# Altium schematic sheet MPPT_MCU.SchDoc
size A3; SheetNumber: 2; SheetTotal: 3
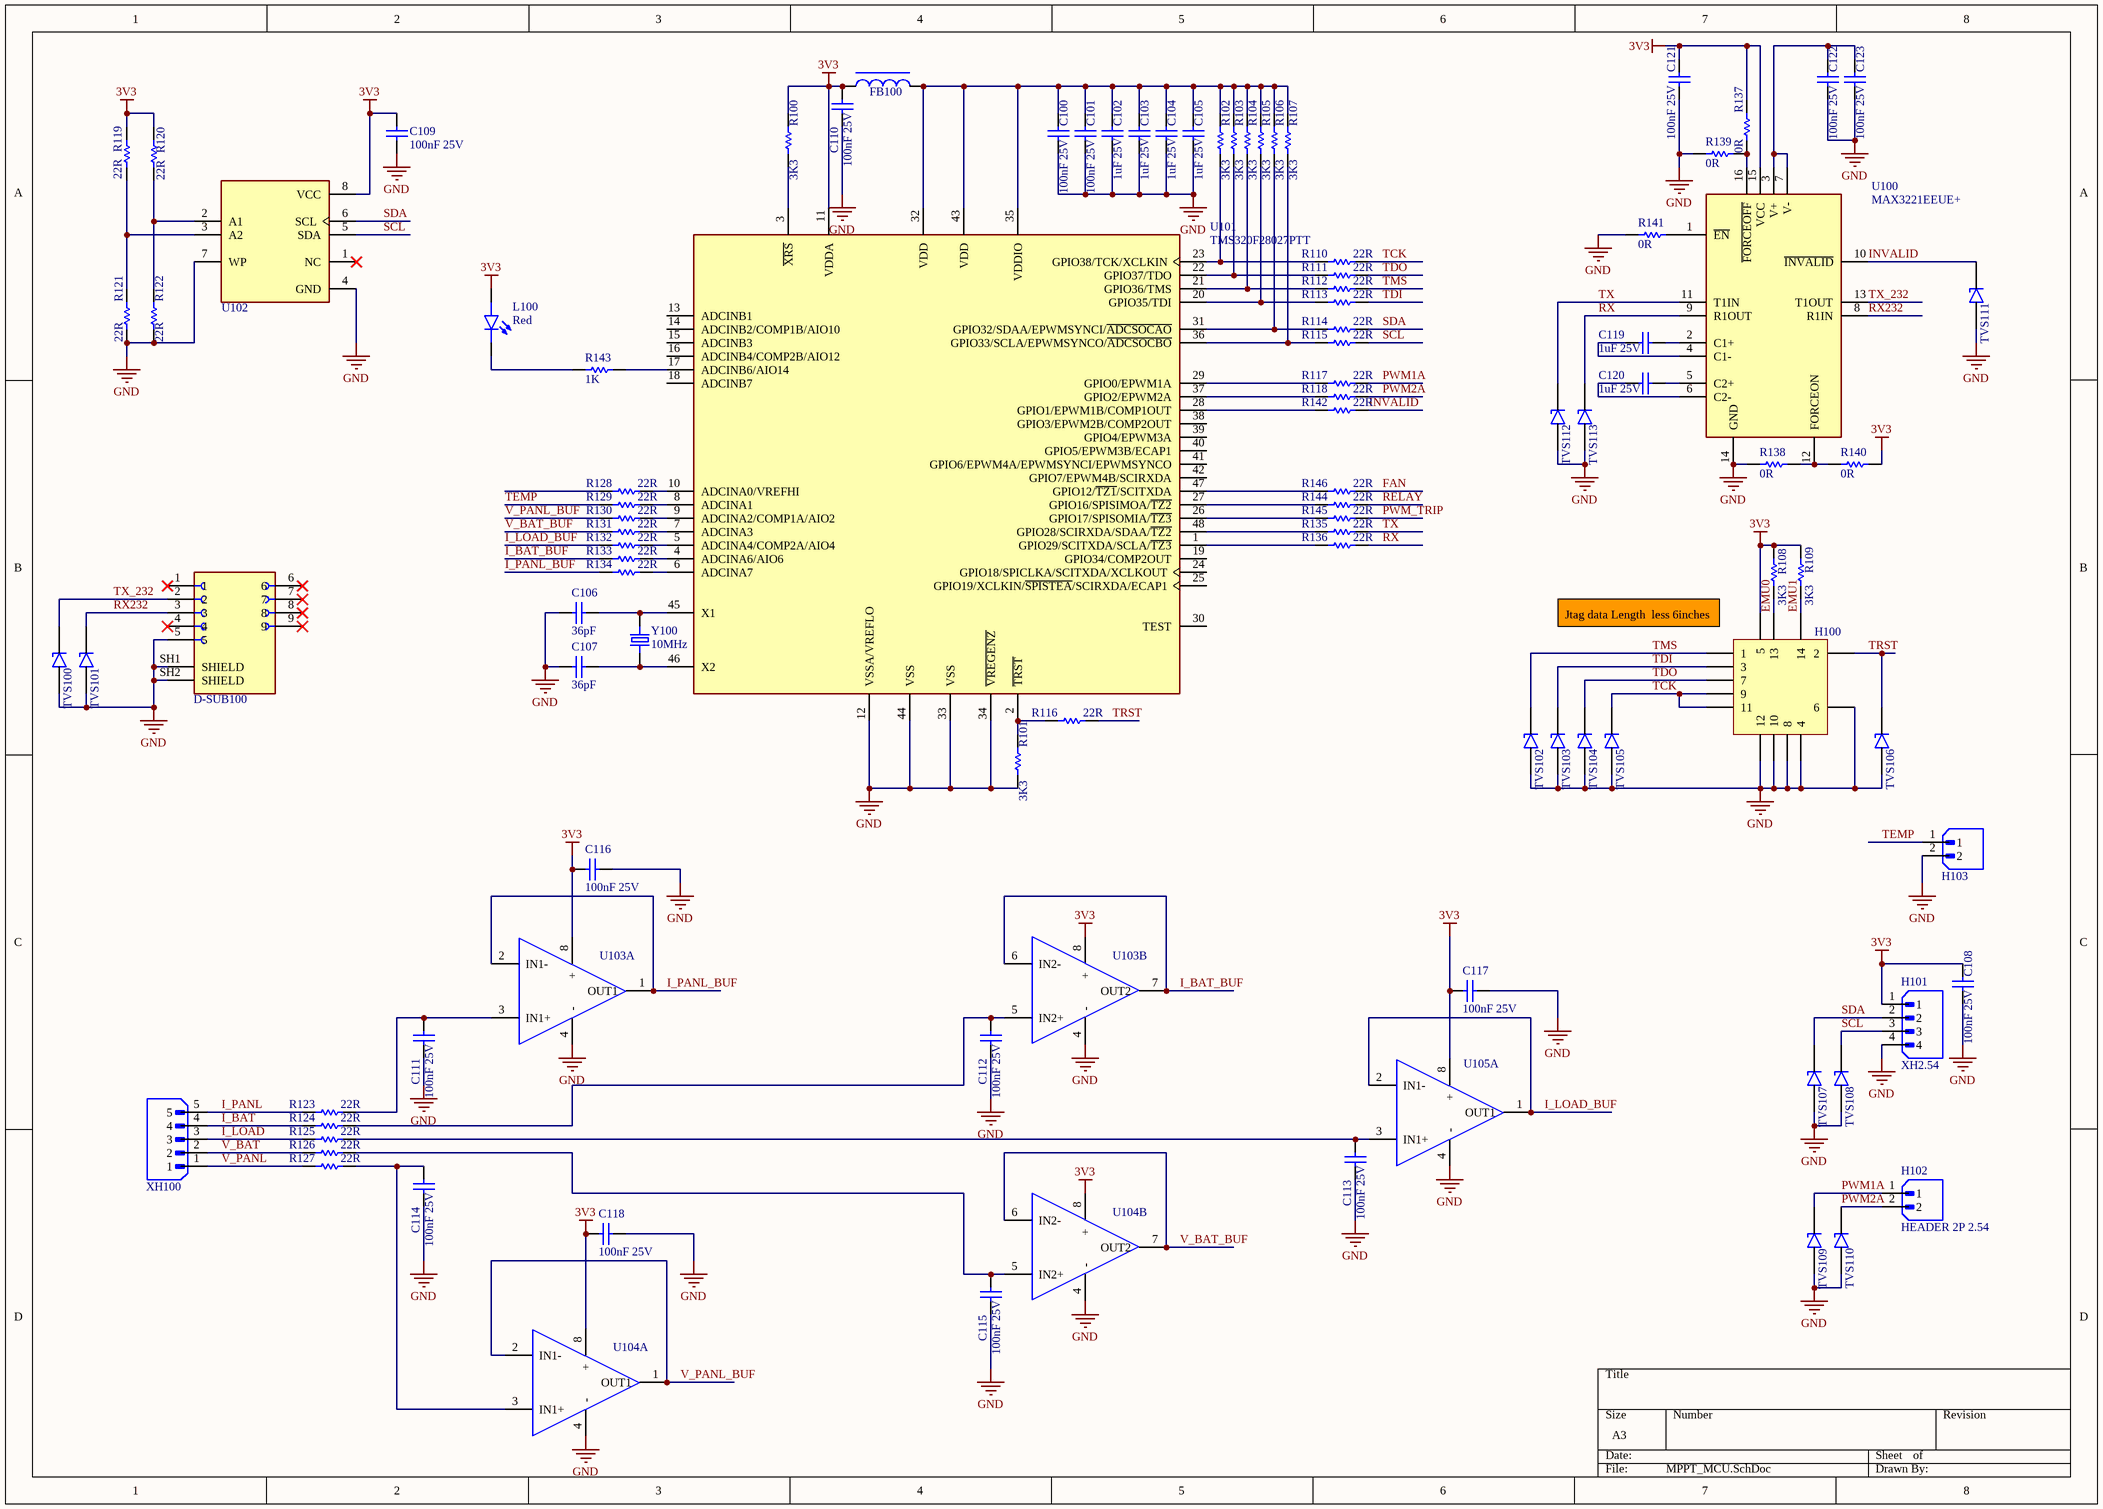
[diagram p0: MPPT_MCU.SchDoc]

## Parts
C100  100nF 25V  [Cap cer 0603]
C101  100nF 25V  [Cap cer 0603]
C102  1uF 25V  [Cap cer 0603]
C103  1uF 25V  [Cap cer 0603]
C104  1uF 25V  [Cap cer 0603]
C105  1uF 25V  [Cap cer 0603]
C106  36pF  [Cap cer 0603]
C107  36pF  [Cap cer 0603]
C108  100nF 25V  [Cap cer 0603]
C109  100nF 25V  [Cap cer 0603]
C110  100nF 25V  [Cap cer 0603]
C111  100nF 25V  [Cap cer 0603]
C112  100nF 25V  [Cap cer 0603]
C113  100nF 25V  [Cap cer 0603]
C114  100nF 25V  [Cap cer 0603]
C115  100nF 25V  [Cap cer 0603]
C116  100nF 25V  [Cap cer 0603]
C117  100nF 25V  [Cap cer 0603]
C118  100nF 25V  [Cap cer 0603]
C119  1uF 25V  [Cap cer 0603]
C120  1uF 25V  [Cap cer 0603]
C121  100nF 25V  [Cap cer 0603]
C122  100nF 25V  [Cap cer 0603]
C123  100nF 25V  [Cap cer 0603]
D-SUB100  9PIN  [D-SUB]  (value not drawn)
FB100  Ferrite Beads Multi-Layer 390Ohm 25% 100MHz 500mA 300mOhm DCR 0603 Automotive T/R  [FERRITE BEAD 0603]  (value not drawn)
H100  HDR2X7 2.54mm  [HDR2X7]  (value not drawn)
H101  XH2.54  [XH2.54]
H102  HEADER 2P 2.54  [HEADER 2P 2.544]
H103  HEADER 2P 2.54  [HEADER 2P 2.544]  (value not drawn)
L100  Red  [Led 0603]
R100  3K3  [Res 0603]
R101  3K3  [Res 0603]
R102  3K3  [Res 0603]
R103  3K3  [Res 0603]
R104  3K3  [Res 0603]
R105  3K3  [Res 0603]
R106  3K3  [Res 0603]
R107  3K3  [Res 0603]
R108  3K3  [Res 0603]
R109  3K3  [Res 0603]
R110  22R  [Res 0603]
R111  22R  [Res 0603]
R112  22R  [Res 0603]
R113  22R  [Res 0603]
R114  22R  [Res 0603]
R115  22R  [Res 0603]
R116  22R  [Res 0603]
R117  22R  [Res 0603]
R118  22R  [Res 0603]
R119  22R  [Res 0603]
R120  22R  [Res 0603]
R121  22R  [Res 0603]
R122  22R  [Res 0603]
R123  22R  [Res 0603]
R124  22R  [Res 0603]
R125  22R  [Res 0603]
R126  22R  [Res 0603]
R127  22R  [Res 0603]
R128  22R  [Res 0603]
R129  22R  [Res 0603]
R130  22R  [Res 0603]
R131  22R  [Res 0603]
R132  22R  [Res 0603]
R133  22R  [Res 0603]
R134  22R  [Res 0603]
R135  22R  [Res 0603]
R136  22R  [Res 0603]
R137  0R  [Res 0603]
R138  0R  [Res 0603]
R139  0R  [Res 0603]
R140  0R  [Res 0603]
R141  0R  [Res 0603]
R142  22R  [Res 0603]
R143  1K  [Res 0603]
R144  22R  [Res 0603]
R145  22R  [Res 0603]
R146  22R  [Res 0603]
TVS100  SMCJ5.0A-13-F  [TVS 5V]  (value not drawn)
TVS101  SMCJ5.0A-13-F  [TVS 5V]  (value not drawn)
TVS102  SMCJ5.0A-13-F  [TVS 5V]  (value not drawn)
TVS103  SMCJ5.0A-13-F  [TVS 5V]  (value not drawn)
TVS104  SMCJ5.0A-13-F  [TVS 5V]  (value not drawn)
TVS105  SMCJ5.0A-13-F  [TVS 5V]  (value not drawn)
TVS106  SMCJ5.0A-13-F  [TVS 5V]  (value not drawn)
TVS107  SMCJ5.0A-13-F  [TVS 5V]  (value not drawn)
TVS108  SMCJ5.0A-13-F  [TVS 5V]  (value not drawn)
TVS109  SMCJ5.0A-13-F  [TVS 5V]  (value not drawn)
TVS110  SMCJ5.0A-13-F  [TVS 5V]  (value not drawn)
TVS111  SMCJ5.0A-13-F  [TVS 5V]  (value not drawn)
TVS112  SMCJ5.0A-13-F  [TVS 5V]  (value not drawn)
TVS113  SMCJ5.0A-13-F  [TVS 5V]  (value not drawn)
U100  MAX3221EEUE+  [max3221]
U101  TMS320F28027PTT  [TMS320F28027PTT]
U102  AT24C04D-SSHM-B  [AT24C04D]  (value not drawn)
U103  LM358DT  [LM358]  (value not drawn)  (parts A,B of 2)
U104  LM358DT  [LM358]  (value not drawn)  (parts A,B of 2)
U105  LM358DT  [LM358]  (value not drawn)  (part A of 2)
XH100  B5B-XH-A(LF)(SN)  [XH2.54 5p]  (value not drawn)
Y100  10MHz  [Crystal 10Mhz]

## Nets
3V3: C108.2 C109.2 C110.2 C116.2 C117.2 C118.2 C121.2 FB100.1 H100.5 H101.1 L100.A R100.2 R108.2 R109.2 R119.2 R120.2 R137.2 R140.1 U100.15(VCC) U101.11(VDDA) U102.8(VCC) U103.8(+) U104.8(+) U105.8(+)
GND: C100.1 C101.1 C102.1 C103.1 C104.1 C105.1 C106.2 C107.2 C108.1 C109.1 C110.1 C111.1 C112.1 C113.1 C114.1 C115.1 C116.1 C117.1 C118.1 C121.1 C122.1 C123.1 D-SUB100.5 D-SUB100.SH1(SHIELD) D-SUB100.SH2(SHIELD) H100.4 H100.6 H100.8 H100.10 H100.12 H101.4 H103.2 R101.1 R121.1 R122.1 R138.2 R139.2 R141.2 TVS100.2(A) TVS101.2(A) TVS102.2(A) TVS103.2(A) TVS104.2(A) TVS105.2(A) TVS106.2(A) TVS107.2(A) TVS108.2(A) TVS109.2(A) TVS110.2(A) TVS111.2(A) TVS112.2(A) TVS113.2(A) U100.14(GND) U101.12(VSSA/VREFLO) U101.33(VSS) U101.34(~{VREGENZ}) U101.44(VSS) U102.4(GND) U102.7(WP) U103.4(-) U104.4(-) U105.4(-)
EMU0: H100.13 R108.1
EMU1: H100.14 R109.1
FAN: R146.2
I_BAT: R124.1 XH100.4
I_BAT_BUF: R133.1 U103.6(IN2-) U103.7(OUT2)
I_LOAD: R125.1 XH100.3
I_LOAD_BUF: R132.1 U105.1(OUT1) U105.2(IN1-)
I_PANL: R123.1 XH100.5
I_PANL_BUF: R134.1 U103.1(OUT1) U103.2(IN1-)
INVALID: R142.2 TVS111.1(C) U100.10(~{INVALID})
PWM1A: H102.1 R117.2 TVS109.1(C)
PWM2A: H102.2 R118.2 TVS110.1(C)
PWM_TRIP: R145.2
RELAY: R144.2
RX: R136.2 TVS113.1(C) U100.9(R1OUT)
RX232: D-SUB100.3 TVS101.1(C) U100.8(R1IN)
SCL: H101.3 R115.2 TVS108.1(C) U102.5(SDA)
SDA: H101.2 R114.2 TVS107.1(C) U102.6(SCL)
TCK: H100.9 H100.11 R110.2 TVS105.1(C)
TDI: H100.3 R113.2 TVS103.1(C)
TDO: H100.7 R111.2 TVS104.1(C)
TEMP: H103.1 R129.1
TMS: H100.1 R112.2 TVS102.1(C)
TRST: H100.2 R116.2 TVS106.1(C)
TX: R135.2 TVS112.1(C) U100.11(T1IN)
TX_232: D-SUB100.2 TVS100.1(C) U100.13(T1OUT)
V_BAT: R126.1 XH100.2
V_BAT_BUF: R131.1 U104.6(IN2-) U104.7(OUT2)
V_PANL: R127.1 XH100.1
V_PANL_BUF: R130.1 U104.1(OUT1) U104.2(IN1-)
NetC100_2: C100.2 C101.2 C102.2 C103.2 C104.2 C105.2 FB100.2 R102.2 R103.2 R104.2 R105.2 R106.2 R107.2 U101.32(VDD) U101.35(VDDIO) U101.43(VDD)
NetC106_1: C106.1 U101.45(X1) Y100.2
NetC107_1: C107.1 U101.46(X2) Y100.1
NetC111_2: C111.2 R123.2 U103.3(IN1+)
NetC112_2: C112.2 R124.2 U103.5(IN2+)
NetC113_2: C113.2 R125.2 U105.3(IN1+)
NetC114_2: C114.2 R127.2 U104.3(IN1+)
NetC115_2: C115.2 R126.2 U104.5(IN2+)
NetC119_1: C119.1 U100.2(C1+)
NetC119_2: C119.2 U100.4(C1-)
NetC120_1: C120.1 U100.5(C2+)
NetC120_2: C120.2 U100.6(C2-)
NetC122_2: C122.2 C123.2 U100.3(V+) U100.7(V-)
NetL100_C: L100.C R143.1
NetR100_1: R100.1 U101.3(~{XRS})
NetR101_2: R101.2 R116.1 U101.2(~{TRST})
NetR102_1: R102.1 R110.1 U101.23(GPIO38/TCK/XCLKIN)
NetR103_1: R103.1 R111.1 U101.22(GPIO37/TDO)
NetR104_1: R104.1 R112.1 U101.21(GPIO36/TMS)
NetR105_1: R105.1 R113.1 U101.20(GPIO35/TDI)
NetR106_1: R106.1 R114.1 U101.31(GPIO32/SDAA/EPWMSYNCI/~{ADCSOCAO})
NetR107_1: R107.1 R115.1 U101.36(GPIO33/SCLA/EPWMSYNCO/~{ADCSOCBO})
NetR117_1: R117.1 U101.29(GPIO0/EPWM1A)
NetR118_1: R118.1 U101.37(GPIO2/EPWM2A)
NetR119_1: R119.1 R121.2 U102.3(A2)
NetR120_1: R120.1 R122.2 U102.2(A1)
NetR128_2: R128.2 U101.10(ADCINA0/VREFHI)
NetR129_2: R129.2 U101.8(ADCINA1)
NetR130_2: R130.2 U101.9(ADCINA2/COMP1A/AIO2)
NetR131_2: R131.2 U101.7(ADCINA3)
NetR132_2: R132.2 U101.5(ADCINA4/COMP2A/AIO4)
NetR133_2: R133.2 U101.4(ADCINA6/AIO6)
NetR134_2: R134.2 U101.6(ADCINA7)
NetR135_1: R135.1 U101.48(GPIO28/SCIRXDA/SDAA/~{TZ2})
NetR136_1: R136.1 U101.1(GPIO29/SCITXDA/SCLA/~{TZ3})
NetR137_1: R137.1 R139.1 U100.16(~{FORCEOFF})
NetR138_1: R138.1 R140.2 U100.12(FORCEON)
NetR141_1: R141.1 U100.1(~{EN})
NetR142_1: R142.1 U101.28(GPIO1/EPWM1B/COMP1OUT)
NetR143_2: R143.2 U101.17(ADCINB6/AIO14)
NetR144_1: R144.1 U101.27(GPIO16/SPISIMOA/~{TZ2})
NetR145_1: R145.1 U101.26(GPIO17/SPISOMIA/~{TZ3})
NetR146_1: R146.1 U101.47(GPIO12/~{TZ1}/SCITXDA)

Not connected (* = marked no-connect by the designer): D-SUB100 1* 4* 6* 7* 8* 9*; R128 1; U101 13(ADCINB1) 14(ADCINB2/COMP1B/AIO10) 15(ADCINB3) 16(ADCINB4/COMP2B/AIO12) 18(ADCINB7) 19(GPIO34/COMP2OUT) 24(GPIO18/SPICLKA/SCITXDA/XCLKOUT) 25(GPIO19/XCLKIN/~{SPISTEA}/SCIRXDA/ECAP1) 30(TEST) 38(GPIO3/EPWM2B/COMP2OUT) 39(GPIO4/EPWM3A) 40(GPIO5/EPWM3B/ECAP1) 41(GPIO6/EPWM4A/EPWMSYNCI/EPWMSYNCO) 42(GPIO7/EPWM4B/SCIRXDA); U102 1(NC)*

## Notes on the sheet
- (near H100) Jtag data Length  less 6inches

## Library data of the parts
C100 C101 C108-C118 C121-C123 = GCM188R71E104KA57D: Multilayer Ceramic Capacitor, 0.1 uF, 25 V, ï¿½ 10%, X7R, 0603 [1608 Metric]; Manufacturer: Murata; Supplier 1: Mouser; Manufacturer Part Number: GCM188R71E104KA57D; RoHS: Yes; Category: Ceramic Capacitors; Stock 1: 52188; Pricing 1: 1=0.26, 10=0.151, 50=0.151, 100=0.097, 1000=0.068, 10000=0.046 (USD); Lead Free: 5697LeadFree; ComponentLink1URL: https://datasheet.ciiva.com/18183/getdatasheetpartid-301637-18183609.pdf?src-supplier=Verical; ComponentLink1Description: https://datasheet.ciiva.com/18183/getdatasheetpartid-301637-18183609.pdf?src-supplier=Verical; ComponentLink2URL: https://datasheet.ciiva.com/3778/11371gcm188r71e104ka5723-3778030.pdf?src-supplier=Arrow+Electronics; ComponentLink2Description: https://datasheet.ciiva.com/3778/11371gcm188r71e104ka5723-3778030.pdf?src-supplier=Arrow+Electronics; ComponentLink3URL: https://datasheet.ciiva.com/6270/s0717e-6270619.pdf?src-supplier=Digikey; ComponentLink3Description: https://datasheet.ciiva.com/6270/s0717e-6270619.pdf?src-supplier=Digikey; ComponentLink4URL: https://datasheet.ciiva.com/6270/s0717e-6270620.pdf?src-supplier=Digikey; ComponentLink4Description: https://datasheet.ciiva.com/6270/s0717e-6270620.pdf?src-supplier=Digikey; ComponentLink5URL: https://datasheet.ciiva.com/6270/s0717e-6270621.pdf?src-supplier=Digikey; ComponentLink5Description: https://datasheet.ciiva.com/6270/s0717e-6270621.pdf?src-supplier=Digikey; Supplier Part Number 1: 81-GCM188R71E104KA7D
C102-C105 C119 C120 = GCM188R71E105KA64J: Ceramic Capacitor, Multilayer, Ceramic, 25V, 10% +Tol, 10% -Tol, X7R, 15% TC, 1uF, Surface Mount, 0603; Manufacturer: Murata; Material: 4241ConductorMaterial; Supplier 1: Mouser; Manufacturer Part Number: GCM188R71E105KA64J; RoHS: Yes; Category: Ceramic Capacitors; Stock 1: 9238; Pricing 1: 1=0.2, 10=0.113, 50=0.113, 100=0.071, 1000=0.047, 10000=0.034 (USD); Mount: Surface Mount; Case/Package: 0603; Case Code (Imperial): 0603; Case Code (Metric): 1608; Weight: 0.000222oz; Min Operating Temperature: -55°C; Max Operating Temperature: 125°C; Capacitance: 1uF; Tolerance: 10%; Dielectric: X7R; Packaging: Tape and Reel; Voltage Rating: 25V; Termination: SMD/SMT; Voltage Rating (DC): 25V; Package Quantity: 10000; Series: GCM; Length: 1.6mm; Width: 0.8mm; Height: 0.8mm; Ratings: AEC-Q200; RoHS Compliant: Yes; ComponentLink1URL: http://www.mouser.com/ds/2/281/c03e-806517.pdf?src-supplier=Mouser; ComponentLink1Description: http://www.mouser.com/ds/2/281/c03e-806517.pdf?src-supplier=Mouser; ComponentLink2URL: https://datasheet.octopart.com/GCM188R71E105KA64J-Murata-datasheet-155345023.pdf?src-supplier=Element14; ComponentLink2Description: https://datasheet.octopart.com/GCM188R71E105KA64J-Murata-datasheet-155345023.pdf?src-supplier=Element14; ComponentLink3URL: https://datasheet.octopart.com/GCM188R71E105KA64J-Murata-datasheet-118179445.pdf?src-supplier=Future+Electronics; ComponentLink3Description: https://datasheet.octopart.com/GCM188R71E105KA64J-Murata-datasheet-118179445.pdf?src-supplier=Future+Electronics; ComponentLink4URL: https://www.murata.com/~/media/webrenewal/support/library/catalog/products/capacitor/mlcc/c03e.ashx?la=en-us&src-supplier=Digikey; ComponentLink4Description: https://www.murata.com/~/media/webrenewal/support/library/catalog/products/capacitor/mlcc/c03e.ashx?la=en-us&src-supplier=Digikey; ComponentLink5URL: https://datasheet.octopart.com/GCM188R71E105KA64J-Murata-datasheet-155345023.pdf?src-supplier=Newark; ComponentLink5Description: https://datasheet.octopart.com/GCM188R71E105KA64J-Murata-datasheet-155345023.pdf?src-supplier=Newark; ComponentLink6URL: https://datasheet.octopart.com/GCM188R71E105KA64J-Murata-datasheet-12511495.pdf?src-supplier=TME; ComponentLink6Description: https://datasheet.octopart.com/GCM188R71E105KA64J-Murata-datasheet-12511495.pdf?src-supplier=TME; Supplier Part Number 1: 81-GCM188R71E105KA4J
C106 C107 = GRM1885C1H360JA01D: Cap Ceramic 36pF 50V C0G 5% SMD 0603 125C T/R; Manufacturer: Murata; Supplier 1: Mouser; Manufacturer Part Number: GRM1885C1H360JA01D; RoHS: Yes; Category: Ceramic Capacitors; Stock 1: 12455; Pricing 1: 1=0.12, 10=0.066, 50=0.066, 100=0.04, 1000=0.026, 10000=0.014 (USD); ComponentLink1URL: https://datasheet.ciiva.com/11606/product-11606656.pdf?src-supplier=Avnet; ComponentLink1Description: https://datasheet.ciiva.com/11606/product-11606656.pdf?src-supplier=Avnet; ComponentLink2URL: https://datasheet.ciiva.com/3779/grm1885c1h360ja0123-3779428.pdf?src-supplier=Arrow+Electronics; ComponentLink2Description: https://datasheet.ciiva.com/3779/grm1885c1h360ja0123-3779428.pdf?src-supplier=Arrow+Electronics; ComponentLink3URL: https://datasheet.ciiva.com/132/partnumbering-e-01-132691.pdf?src-supplier=Digikey; ComponentLink3Description: https://datasheet.ciiva.com/132/partnumbering-e-01-132691.pdf?src-supplier=Digikey; ComponentLink4URL: https://datasheet.ciiva.com/132/partnumbering-e-01-132692.pdf?src-supplier=Digikey; ComponentLink4Description: https://datasheet.ciiva.com/132/partnumbering-e-01-132692.pdf?src-supplier=Digikey; ComponentLink5URL: https://datasheet.ciiva.com/132/partnumbering-e-01-132693.pdf?src-supplier=Digikey; ComponentLink5Description: https://datasheet.ciiva.com/132/partnumbering-e-01-132693.pdf?src-supplier=Digikey; ComponentLink6URL: https://datasheet.ciiva.com/11606/product-11606605.pdf?src-supplier=Avnet; ComponentLink6Description: https://datasheet.ciiva.com/11606/product-11606605.pdf?src-supplier=Avnet; Supplier Part Number 1: 81-GRM39C360J50
D-SUB100 = 5747844-6: Conn D-Subminiature SKT 9 POS 2.74mm Solder RA Thru-Hole 9 Terminal 1 Port Tray; Manufacturer: TE Connectivity AMP; Supplier 1: Avnet; Manufacturer Part Number: 5747844-6; RoHS: Yes; Category: D-Sub Connectors; Stock 1: 15437; Pricing 1: 1=2,25787, 10=2,21046, 30=2,11568, 50=2,05269, 100=1,97366 (USD); ComponentLink1URL: http://datasheet.octopart.com/5747844-6-TE-Connectivity-datasheet-10978930.pdf?src-supplier=Newark; ComponentLink1Description: http://datasheet.octopart.com/5747844-6-TE-Connectivity-datasheet-10978930.pdf?src-supplier=Newark; ComponentLink2URL: http://datasheet.octopart.com/5747844-6-TE-Connectivity-datasheet-10978930.pdf?src-supplier=Rs; ComponentLink2Description: http://datasheet.octopart.com/5747844-6-TE-Connectivity-datasheet-10978930.pdf?src-supplier=Rs; ComponentLink3URL: http://datasheet.octopart.com/5747844-6-TE-Connectivity-datasheet-10978930.pdf?src-supplier=Distrelec; ComponentLink3Description: http://datasheet.octopart.com/5747844-6-TE-Connectivity-datasheet-10978930.pdf?src-supplier=Distrelec; ComponentLink4URL: https://datasheet.octopart.com/5747844-6-Tyco-Electronics-datasheet-5330706.pdf?src-supplier=Future+Electronics; ComponentLink4Description: https://datasheet.octopart.com/5747844-6-Tyco-Electronics-datasheet-5330706.pdf?src-supplier=Future+Electronics; ComponentLink5URL: http://datasheet.octopart.com/5747844-6-TE-Connectivity-datasheet-10978930.pdf?src-supplier=Onlinecomponents.com; ComponentLink5Description: http://datasheet.octopart.com/5747844-6-TE-Connectivity-datasheet-10978930.pdf?src-supplier=Onlinecomponents.com; ComponentLink6URL: https://www.te.com/commerce/DocumentDelivery/DDEController?Action=srchrtrv&amp;DocNm=5747844&amp;DocType=Customer+Drawing&amp;DocLang=English&src-supplier=Digikey; ComponentLink6Description: https://www.te.com/commerce/DocumentDelivery/DDEController?Action=srchrtrv&amp;DocNm=5747844&amp;DocType=Customer+Drawing&amp;DocLang=English&src-supplier=Digikey; ComponentLink7URL: http://datasheet.octopart.com/5747844-6-TE-Connectivity-datasheet-10978930.pdf?src-supplier=TTI; ComponentLink7Description: http://datasheet.octopart.com/5747844-6-TE-Connectivity-datasheet-10978930.pdf?src-supplier=TTI; ComponentLink8URL: http://datasheet.octopart.com/5747844-6-TE-Connectivity-datasheet-10978930.pdf?src-supplier=Quest; ComponentLink8Description: http://datasheet.octopart.com/5747844-6-TE-Connectivity-datasheet-10978930.pdf?src-supplier=Quest; ComponentLink9URL: http://datasheet.octopart.com/5747844-6-TE-Connectivity-datasheet-10978930.pdf?src-supplier=TME; ComponentLink9Description: http://datasheet.octopart.com/5747844-6-TE-Connectivity-datasheet-10978930.pdf?src-supplier=TME; ComponentLink10URL: http://datasheet.octopart.com/5747844-6-TE-Connectivity-datasheet-10978930.pdf?src-supplier=Heilind+Electronics; ComponentLink10Description: http://datasheet.octopart.com/5747844-6-TE-Connectivity-datasheet-10978930.pdf?src-supplier=Heilind+Electronics; ComponentLink11URL: http://datasheet.octopart.com/5747844-6-TE-Connectivity-datasheet-10978930.pdf?src-supplier=Sager+Electronics; ComponentLink11Description: http://datasheet.octopart.com/5747844-6-TE-Connectivity-datasheet-10978930.pdf?src-supplier=Sager+Electronics; Supplier Part Number 1: 5747844-6
FB100 = Ferrite Bead: Manufacturer: Murata; Manufacturer Part Number: BLM18EG391TH1D; Impedance: 390R; Number of Circuits: 1; Supplier 1: Digikey; RoHS: Yes; Category: Ferrite Beads and Chips; Pricing 1: 4000=0,0747 (USD); Mount: Surface Mount; Case/Package: 0603; Case Code (Imperial): 0603; Min Operating Temperature: -55°C; Max Operating Temperature: 125°C; Packaging: Tape and Reel; Tolerance: 25%; Package Quantity: 4000; Termination: SMD/SMT; Test Frequency: 100MHz; Max DC Current: 500mA; Series: EMIFIL®, BLM18; Number of Lines: 1; Length: 1.6mm; Width: 0.8mm; Height: 0.8mm; Depth: 0.95mm; RoHS Compliant: Yes; ComponentLink1URL: https://datasheet.ciiva.com/8510/l0132s0193blm18e-shth-8510168.pdf?src-supplier=Avnet; ComponentLink1Description: https://datasheet.ciiva.com/8510/l0132s0193blm18e-shth-8510168.pdf?src-supplier=Avnet; Supplier Part Number 1: BLM18EG391TH1D-ND
H100 = HDR2X7
H101 = B4B-XH-A: Board Connector, 4 Contact(s), 1 Row(s), Male, Straight, Solder Terminal,; Manufacturer: JST; Current Rating: 3A; Contact Resistance: 10mR; Insulation Resistance: 1GR; Supplier 1: Digikey; Manufacturer Part Number: B4B-XH-A; RoHS: Yes; Category: FFC / FPC; Stock 1: 162362; Pricing 1: 1=0.17, 10=0.149, 100=0.1262, 500=0.1126, 1000=0.10721, 5000=0.09569, 10000=0.09112 (USD); Number of Pins: 4; Contact Material: Bronze,Tin; Housing Material: Nylon; Orientation: Straight; Series: XH; ComponentLink1URL: https://datasheet.ciiva.com/14155/xh-series-eng-tds-14155433.pdf?src-supplier=Distrelec; ComponentLink1Description: https://datasheet.ciiva.com/14155/xh-series-eng-tds-14155433.pdf?src-supplier=Distrelec; Supplier Part Number 1: 455-B4B-XH-A-ND
H102 H103 = B2B-XH-A(LF)(SN): CONNECTOR HEADER, XH SERIES, 2 POSITION, 2.50MM, Press-Fit Solder, Detent Lock, Natural; Manufacturer: JST; Current Rating: 3A; Number of Positions: 2; Contact Resistance: 20mR; Insulation Resistance: 1GR; Voltage Rating: 250V; Pitch: 2.5mm; Wire/Cable Gauge: 22AWG; Supplier 1: Future Electronics; Manufacturer Part Number: B2B-XH-A(LF)(SN); RoHS: Yes; Category: Headers and Wire Housings; Stock 1: 138390; Pricing 1: 1=0,0544, 500=0,0528, 1500=0,0514, 5000=0,0499, 15000=0,0472 (USD); Mount: Through Hole; Contact Material: Brass; Contact Plating: Tin,Lead,Copper; Housing Material: Polyamide; Color: Natural; Housing Color: White; Weight: 28.349523g; Min Operating Temperature: -25°C; Max Operating Temperature: 85°C; Termination: Solder; Number of Rows: 1; Packaging: Bulk; Series: XH; Orientation: Straight; Contact Type: Male Pin; Max Current Rating: 3A; Fastening Type: Detent; Max Voltage Rating (AC): 250V; Number of Contacts: 2; Voltage Rating (AC): 250V; Max Voltage Rating (DC): 250V; Length: 7.4mm; Depth: 5.75mm; Lead Pitch: 2.5mm; Lead Free: Lead Free; Reach SVHC Compliant: No; ComponentLink1URL: https://datasheet.ciiva.com/11746/0900766b8082653e-11746979.pdf?src-supplier=Rs; ComponentLink1Description: https://datasheet.ciiva.com/11746/0900766b8082653e-11746979.pdf?src-supplier=Rs; ComponentLink2URL: https://datasheet.ciiva.com/26894/getdatasheetpartid-385291-26894760.pdf?src-supplier=Verical; ComponentLink2Description: https://datasheet.ciiva.com/26894/getdatasheetpartid-385291-26894760.pdf?src-supplier=Verical; ComponentLink3URL: https://datasheet.ciiva.com/26894/getdatasheetpartid-640357-26894434.pdf?src-supplier=Verical; ComponentLink3Description: https://datasheet.ciiva.com/26894/getdatasheetpartid-640357-26894434.pdf?src-supplier=Verical; ComponentLink4URL: https://datasheet.ciiva.com/8052/5448-8052024.pdf?src-supplier=Element14; ComponentLink4Description: https://datasheet.ciiva.com/8052/5448-8052024.pdf?src-supplier=Element14; Supplier Part Number 1: 1638840
L100 = 597-5004-407F: LED Uni-Color Red 2-Pin Chip 0603(1608Metric) T/R; Manufacturer: Dialight; Supplier 1: Newark; Manufacturer Part Number: 597-5004-407F; RoHS: Yes; Category: LEDs; ComponentLink1URL: https://datasheet.ciiva.com/4689/597-xxxx-4xx-186206-4689201.pdf?src-supplier=Mouser; ComponentLink1Description: https://datasheet.ciiva.com/4689/597-xxxx-4xx-186206-4689201.pdf?src-supplier=Mouser; ComponentLink2URL: https://datasheet.ciiva.com/7970/597-xxxx-4xx-7970142.pdf?src-supplier=Element14; ComponentLink2Description: https://datasheet.ciiva.com/7970/597-xxxx-4xx-7970142.pdf?src-supplier=Element14; ComponentLink3URL: https://datasheet.ciiva.com/16499/smt-selector-guide-16499487.pdf?src-supplier=Future+Electronics; ComponentLink3Description: https://datasheet.ciiva.com/16499/smt-selector-guide-16499487.pdf?src-supplier=Future+Electronics; ComponentLink4URL: https://datasheet.ciiva.com/6350/c16413-6350297.pdf?src-supplier=Digikey; ComponentLink4Description: https://datasheet.ciiva.com/6350/c16413-6350297.pdf?src-supplier=Digikey; ComponentLink5URL: https://datasheet.ciiva.com/6350/c16413-6350298.pdf?src-supplier=Digikey; ComponentLink5Description: https://datasheet.ciiva.com/6350/c16413-6350298.pdf?src-supplier=Digikey; ComponentLink6URL: https://datasheet.ciiva.com/6350/c16413-6350301.pdf?src-supplier=Digikey; ComponentLink6Description: https://datasheet.ciiva.com/6350/c16413-6350301.pdf?src-supplier=Digikey; Supplier Part Number 1: 30K5000
R100-R109 = Resistor 10K: Res Thick Film 0603 10K Ohm 5% 1/10W |200ppm/|C SMD Paper T/R; Manufacturer: Vishay Dale; Manufacturer Part Number: CRCW060310K0JNEA; Resistance: 10kR; Temperature Coefficient: 200ppm/°C; Voltage Rating (DC): 75V; Power Rating: 100mW; Supplier 1: Arrow Electronics; RoHS: Yes; Category: Chip SMD Resistors; Stock 1: 5905000; Pricing 1: 5000=0.0041, 10000=0.003, 50000=0.0025 (USD); Mount: Surface Mount; Case/Package: 0603; Number of Pins: 2NUMBER; Case Code (Metric): 1608; Case Code (Imperial): 0603; Contact Plating: Tin; Weight: 7.1E-05oz; Size Code: 0603; Min Operating Temperature: -55°C; Max Operating Temperature: 155°C; Tolerance: 5%; Packaging: Tape and Reel; Voltage Rating: 75V; Resistor Type: Thick Film; Number of Terminations: 2; Termination: SMD/SMT; Max Power Dissipation: 100mW; Features: Automotive AEC-Q200; Series: CRCW; Resistance Tolerance: 5%; Package Quantity: 1; Construction: Rectangular; Length: 1.55mm; Width: 0.033inch; Height: 0.02inch; Depth: 0.85mm; Ratings: AEC-Q200; Radiation Hardening: No; Lead Free: 5697LeadFree; RoHS Compliant: Yes; Reach SVHC Compliant: Unknown; Military Standard: Not; ComponentLink1URL: https://datasheet.ciiva.com/2461/dcrcwe3-2461973.pdf?src-supplier=Digikey; ComponentLink1Description: https://datasheet.ciiva.com/2461/dcrcwe3-2461973.pdf?src-supplier=Digikey; ComponentLink2URL: https://datasheet.ciiva.com/16755/70201119-16755717.pdf?src-supplier=Allied+Electronics; ComponentLink2Description: https://datasheet.ciiva.com/16755/70201119-16755717.pdf?src-supplier=Allied+Electronics; ComponentLink3URL: https://datasheet.ciiva.com/3256/dcrcwe3-3256942.pdf?src-supplier=Avnet; ComponentLink3Description: https://datasheet.ciiva.com/3256/dcrcwe3-3256942.pdf?src-supplier=Avnet; ComponentLink4URL: https://datasheet.ciiva.com/16771/70201119-16771051.pdf?src-supplier=Allied+Electronics; ComponentLink4Description: https://datasheet.ciiva.com/16771/70201119-16771051.pdf?src-supplier=Allied+Electronics; ComponentLink5URL: https://datasheet.ciiva.com/3256/dcrcwe3-3256943.pdf?src-supplier=Avnet; ComponentLink5Description: https://datasheet.ciiva.com/3256/dcrcwe3-3256943.pdf?src-supplier=Avnet; ComponentLink6URL: https://datasheet.ciiva.com/16343/dcrcwe3-16343525.pdf?src-supplier=Future+Electronics; ComponentLink6Description: https://datasheet.ciiva.com/16343/dcrcwe3-16343525.pdf?src-supplier=Future+Electronics; ComponentLink7URL: https://datasheet.ciiva.com/2461/dcrcwe3-2461972.pdf?src-supplier=Digikey; ComponentLink7Description: https://datasheet.ciiva.com/2461/dcrcwe3-2461972.pdf?src-supplier=Digikey; ComponentLink8URL: https://datasheet.ciiva.com/2461/dcrcwe3-2461971.pdf?src-supplier=Digikey; ComponentLink8Description: https://datasheet.ciiva.com/2461/dcrcwe3-2461971.pdf?src-supplier=Digikey; Supplier Part Number 1: CRCW060310K0JNEA
R110-R142 R144-R146 = Resistor 22R: Res Thick Film 0603 22 Ohm 5% 1/10W ±200ppm/°C Molded SMD SMD Paper Tape on Plastic Reel; Manufacturer: Bourns; Manufacturer Part Number: CR0603-JW-220ELF; Voltage Rating (DC): 50V; Supplier 1: Arrow Electronics; RoHS: Yes; Category: Chip SMD Resistors; Stock 1: 20153; Pricing 1: 20153=0.003 (USD); Number of Pins: 2NUMBER; ComponentLink1URL: https://datasheet.ciiva.com/23776/1902866-23776395.pdf?src-supplier=Newark; ComponentLink1Description: https://datasheet.ciiva.com/23776/1902866-23776395.pdf?src-supplier=Newark; ComponentLink2URL: https://datasheet.ciiva.com/46394/1791942-46394390.pdf?src-supplier=Element14; ComponentLink2Description: https://datasheet.ciiva.com/46394/1791942-46394390.pdf?src-supplier=Element14; ComponentLink3URL: https://datasheet.ciiva.com/7986/1896408-7986202.pdf?src-supplier=Element14; ComponentLink3Description: https://datasheet.ciiva.com/7986/1896408-7986202.pdf?src-supplier=Element14; ComponentLink4URL: https://datasheet.ciiva.com/6564/chpreztr-6564443.pdf?src-supplier=Digikey; ComponentLink4Description: https://datasheet.ciiva.com/6564/chpreztr-6564443.pdf?src-supplier=Digikey; ComponentLink5URL: https://datasheet.ciiva.com/6564/chpreztr-6564445.pdf?src-supplier=Digikey; ComponentLink5Description: https://datasheet.ciiva.com/6564/chpreztr-6564445.pdf?src-supplier=Digikey; ComponentLink6URL: https://datasheet.ciiva.com/6564/chpreztr-6564447.pdf?src-supplier=Digikey; ComponentLink6Description: https://datasheet.ciiva.com/6564/chpreztr-6564447.pdf?src-supplier=Digikey; ComponentLink7URL: https://datasheet.ciiva.com/9121/chpreztr-9121850.pdf?src-supplier=Avnet; ComponentLink7Description: https://datasheet.ciiva.com/9121/chpreztr-9121850.pdf?src-supplier=Avnet; Supplier Part Number 1: CR0603-JW-220ELF
R143 = Resistor 2.2K: Res Thick Film 0603 2.2K Ohm 5% 1/10W ±200ppm/°C Molded SMD SMD Paper T/R; Manufacturer: Vishay; Manufacturer Part Number: CRCW06032K20JNEA; Resistance: 2.2kR; Power Rating: 100mW; Voltage Rating: 75V; Supplier 1: Arrow Electronics; RoHS: Yes; Category: Chip SMD Resistors; Stock 1: 130000; Pricing 1: 5000=0.0053 (USD); Case/Package: 0603; Weight: 7.1E-05oz; Case Code (Metric): 1608; Case Code (Imperial): 0603; Contact Plating: Tin; Size Code: 0603; Min Operating Temperature: -55°C; Max Operating Temperature: 155°C; Package Quantity: 5000; Tolerance: 5%; Packaging: Tape and Reel; Resistor Type: Thick Film; Number of Terminations: 2; Temperature Coefficient: 200ppm/°C; Termination: SMD/SMT; Max Power Dissipation: 100mW; Features: Automotive AEC-Q200; Series: CRCW; Resistance Tolerance: 5%; Construction: Rectangular; Length: 1.55mm; Width: 0.85mm; Height: 0.45mm; Depth: 0.85mm; Ratings: AEC-Q200; Radiation Hardening: No; Military Standard: Not; RoHS Compliant: Yes; Reach SVHC Compliant: Unknown; Lead Free: 5697LeadFree; ComponentLink1URL: https://datasheet.ciiva.com/2462/dcrcwe3-2462048.pdf?src-supplier=Digikey; ComponentLink1Description: https://datasheet.ciiva.com/2462/dcrcwe3-2462048.pdf?src-supplier=Digikey; ComponentLink2URL: https://datasheet.ciiva.com/16767/70201119-16767464.pdf?src-supplier=Allied+Electronics; ComponentLink2Description: https://datasheet.ciiva.com/16767/70201119-16767464.pdf?src-supplier=Allied+Electronics; ComponentLink3URL: https://datasheet.ciiva.com/2462/dcrcwe3-2462046.pdf?src-supplier=Digikey; ComponentLink3Description: https://datasheet.ciiva.com/2462/dcrcwe3-2462046.pdf?src-supplier=Digikey; ComponentLink4URL: https://datasheet.ciiva.com/5541/dcrcwe3-109170-5541959.pdf?src-supplier=Mouser; ComponentLink4Description: https://datasheet.ciiva.com/5541/dcrcwe3-109170-5541959.pdf?src-supplier=Mouser; ComponentLink5URL: https://datasheet.ciiva.com/16286/dcrcwe3-16286997.pdf?src-supplier=Future+Electronics; ComponentLink5Description: https://datasheet.ciiva.com/16286/dcrcwe3-16286997.pdf?src-supplier=Future+Electronics; Supplier Part Number 1: CRCW06032K20JNEA
TVS100-TVS113 = SMCJ5.0A-13-F: SMCJ5.0A Series 1500 W 5.0 V Surface Mount Uni-Directional TVS Diode - DO-214AB; Manufacturer: Diodes; Voltage Rating (DC): 51V; Forward Voltage: 3.5V; Direction: Unidirectional; Reverse Breakdown Voltage: 6.4V; Max Surge Current: 200A; Number of Unidirectional Channels: 1; Reverse Standoff Voltage: 5V; Clamping Voltage: 9.2V; Peak Pulse Power: 1.5kW; Power Line Protection: No; Peak Pulse Current: 163A; Test Current: 10mA; Max Breakdown Voltage: 7.07V; Max Reverse Leakage Current: 1mA; Capacitance: 7nF; Diode Type: ZENER; Supplier 1: Digikey; Manufacturer Part Number: SMCJ5.0A-13-F; RoHS: Yes; Category: TVS Diodes; Stock 1: 6833; Pricing 1: 1=0,72, 10=0,569, 100=0,32, 500=0,306, 1000=0,29 (USD); Mount: Surface Mount; Case/Package: SMC; Number of Pins: 2; Min Operating Temperature: -55°C; Max Operating Temperature: 150°C; Package Quantity: 3000; Packaging: Tape and Reel; Min Breakdown Voltage: 6.4V; Polarity: Unidirectional; Termination: SMD/SMT; Working Voltage: 5V; Breakdown Voltage: 6.4V; Max Power Dissipation: 1.5kW; Number of Elements: 1; Power Dissipation: 1.5kW; Leakage Current: 1mA; Max Output Current: 163A; Series: -; Clamping Voltage-Max: 9.2V; Length: 7.11mm; Width: 6.22mm; Height: 2.62mm; Radiation Hardening: No; Lead Free: Lead Free; RoHS Compliant: Yes; ComponentLink1URL: https://datasheet.ciiva.com/336/ds19003-336384.pdf?src-supplier=Digikey; ComponentLink1Description: https://datasheet.ciiva.com/336/ds19003-336384.pdf?src-supplier=Digikey; ComponentLink2URL: https://datasheet.ciiva.com/15143/getdatasheetpartid-171808-15143868.pdf?src-supplier=Verical; ComponentLink2Description: https://datasheet.ciiva.com/15143/getdatasheetpartid-171808-15143868.pdf?src-supplier=Verical; Supplier Part Number 1: SMCJ5.0A-FDICT-ND
U100 = MAX3221EEUE+: MAX3221 Series 250 kbps 5.5V Surface Mount RS-232 Transceiver - TSSOP-16; Manufacturer: Maxim; Supplier 1: Mouser; Manufacturer Part Number: MAX3221EEUE+; RoHS: Yes; Category: Buffers, Drivers and Transceivers; Stock 1: 3957; Pricing 1: 1=7,14, 10=5,98, 50=5,9, 100=5, 1000=5, 10000=4,81 (USD); ComponentLink1URL: https://datasheet.ciiva.com/3028/max3221e-max3243e-3028482.pdf?src-supplier=Avnet; ComponentLink1Description: https://datasheet.ciiva.com/3028/max3221e-max3243e-3028482.pdf?src-supplier=Avnet; ComponentLink2URL: https://datasheet.ciiva.com/1713/max3221e-max3243e-1713134.pdf?src-supplier=Digikey; ComponentLink2Description: https://datasheet.ciiva.com/1713/max3221e-max3243e-1713134.pdf?src-supplier=Digikey; Supplier Part Number 1: 700-MAX3221EEUE
U101 = TMS320F28027PTT: C2000™ 32-bit MCU with 60 MHz, 64 KB flash 48-LQFP -40 to 105; Manufacturer: Maxim; Manufacturer Part Number: MAX3221EEUE+; Number of A/D Converters: 1NUMBER; Supplier 1: Mouser; Supplier Part Number 1: 595-TMS320F28027PTT; Supplier 2: Mouser; RoHS: Yes; Category: Buffers, Drivers and Transceivers; Stock 2: 3957; Pricing 2: 1=7,14, 10=5,98, 50=5,9, 100=5, 1000=5, 10000=4,81 (USD); ComponentLink1URL: https://datasheet.ciiva.com/3028/max3221e-max3243e-3028482.pdf?src-supplier=Avnet; ComponentLink1Description: https://datasheet.ciiva.com/3028/max3221e-max3243e-3028482.pdf?src-supplier=Avnet; ComponentLink2URL: https://datasheet.ciiva.com/1713/max3221e-max3243e-1713134.pdf?src-supplier=Digikey; ComponentLink2Description: https://datasheet.ciiva.com/1713/max3221e-max3243e-1713134.pdf?src-supplier=Digikey; Stock 1: 289; Pricing 1: 1=10,22, 10=7,9, 25=7,53, 50=7,53, 100=6,54, 250=6,24, 500=5,69, 1000=4,96, 2500=4,77, 10000=4,96 (USD); Thickness: 1.4mm; Lead Free: 5697LeadFree; ComponentLink3URL: https://datasheet.ciiva.com/6656/tms320f28020-6656816.pdf?src-supplier=Digikey; ComponentLink3Description: https://datasheet.ciiva.com/6656/tms320f28020-6656816.pdf?src-supplier=Digikey; ComponentLink4URL: https://datasheet.ciiva.com/3203/tms320f28026-3203576.pdf?src-supplier=Avnet; ComponentLink4Description: https://datasheet.ciiva.com/3203/tms320f28026-3203576.pdf?src-supplier=Avnet; ComponentLink5URL: https://datasheet.ciiva.com/28626/1827035-28626846.pdf?src-supplier=Element14; ComponentLink5Description: https://datasheet.ciiva.com/28626/1827035-28626846.pdf?src-supplier=Element14; Supplier Part Number 2: 700-MAX3221EEUE
U102 = AT24C04D-SSHM-B: AT24C04D Series 4 Kb (512 x 8) 1.7 V SMT I2C Compatible Serial EEPROM - SOIC-8; Manufacturer: Microchip; Memory Size: 512B; Supplier 1: Arrow Electronics; Manufacturer Part Number: AT24C04D-SSHM-B; RoHS: Yes; Stock 1: 1699; Pricing 1: 1=0,2175, 10=0,2121, 100=0,2065, 1000=0,2061 (USD); Height: 1.75mm; ComponentLink1URL: https://datasheet.ciiva.com/48502/atmel-8896-seeprom-at24c04d-datasheet-48502028.pdf?src-supplier=Avnet; ComponentLink1Description: https://datasheet.ciiva.com/48502/atmel-8896-seeprom-at24c04d-datasheet-48502028.pdf?src-supplier=Avnet; Supplier Part Number 1: AT24C04D-SSHM-B
U103-U105 = LM358DT: Operational Amplifier, 2-Channels, 1.1 MHz, 0.6 V/us, 3 V to 30 V, 8 Pins, SOIC; Manufacturer: STMicroelectronics; Supplier 1: Arrow Electronics; Manufacturer Part Number: LM358DT; RoHS: Yes; Category: Amplifiers - Op Amps, Buffer, Instrumentation; Stock 1: 6035000; Pricing 1: 2500=0,0596, 10000=0,056, 20000=0,0553 (USD); Lead Free: 5697LeadFree; ComponentLink1URL: https://datasheet.ciiva.com/15129/getdatasheetpartid-39583-15129679.pdf?src-supplier=Verical; ComponentLink1Description: https://datasheet.ciiva.com/15129/getdatasheetpartid-39583-15129679.pdf?src-supplier=Verical; ComponentLink2URL: https://datasheet.ciiva.com/29306/155599-da-01-en-op-verst-lm358dt-stm-29306826.pdf?src-supplier=Conrad; ComponentLink2Description: https://datasheet.ciiva.com/29306/155599-da-01-en-op-verst-lm358dt-stm-29306826.pdf?src-supplier=Conrad; ComponentLink3URL: https://datasheet.ciiva.com/14544/70013561-14544747.pdf?src-supplier=Allied+Electronics; ComponentLink3Description: https://datasheet.ciiva.com/14544/70013561-14544747.pdf?src-supplier=Allied+Electronics; ComponentLink4URL: https://datasheet.ciiva.com/16371/cd00000464-16371207.pdf?src-supplier=Future+Electronics; ComponentLink4Description: https://datasheet.ciiva.com/16371/cd00000464-16371207.pdf?src-supplier=Future+Electronics; ComponentLink5URL: https://datasheet.ciiva.com/1795/cd00000464-1795490.pdf?src-supplier=Digikey; ComponentLink5Description: https://datasheet.ciiva.com/1795/cd00000464-1795490.pdf?src-supplier=Digikey; ComponentLink6URL: https://datasheet.ciiva.com/1795/cd00000464-1795491.pdf?src-supplier=Digikey; ComponentLink6Description: https://datasheet.ciiva.com/1795/cd00000464-1795491.pdf?src-supplier=Digikey; ComponentLink7URL: https://datasheet.ciiva.com/1795/cd00000464-1795492.pdf?src-supplier=Digikey; ComponentLink7Description: https://datasheet.ciiva.com/1795/cd00000464-1795492.pdf?src-supplier=Digikey; Supplier Part Number 1: LM358DT
XH100 = B5B-XH-A(LF)(SN): Connector Header, XH Series, 5 Position, 2.50mm, Through Hole, Press-Fit, Solder, Natural; Manufacturer: JST; Voltage Rating: 250V; Number of Positions: 5; Gender: 29Gender; Contact Post Length: 0.134inch; Mated Stacking Heights: 9.8mm; Supplier 1: Future Electronics; Manufacturer Part Number: B5B-XH-A(LF)(SN); RoHS: Yes; Category: Headers and Wire Housings; Stock 1: 3816; Pricing 1: 1=0,106, 250=0,103, 1000=0,0996, 2500=0,0972, 10000=0,0916 (USD); Mount: Through Hole; Contact Material: Brass; Contact Shape: Square; Contact Finish - Mating: TIN; Insulation Material: Nylon; Insulation Color: Natural; Weight: 28.349523g; Min Operating Temperature: -25°C; Max Operating Temperature: 85°C; Number of Rows: 1; Packaging: Bulk; Termination: Press-Fit; Fastening Type: Detent; Connector Type: Header; Series: XH; Contact Type: Male Pin; Insulation Height: 0.276inch; Lead Free: Lead Free; Flammability Rating: UL94 V-0; ComponentLink1URL: https://datasheet.ciiva.com/26894/getdatasheetpartid-455618-26894798.pdf?src-supplier=Verical; ComponentLink1Description: https://datasheet.ciiva.com/26894/getdatasheetpartid-455618-26894798.pdf?src-supplier=Verical; ComponentLink2URL: https://datasheet.ciiva.com/11746/0900766b8082f55f-11746654.pdf?src-supplier=Rs; ComponentLink2Description: https://datasheet.ciiva.com/11746/0900766b8082f55f-11746654.pdf?src-supplier=Rs; ComponentLink3URL: https://datasheet.ciiva.com/26894/getdatasheetpartid-640991-26894479.pdf?src-supplier=Verical; ComponentLink3Description: https://datasheet.ciiva.com/26894/getdatasheetpartid-640991-26894479.pdf?src-supplier=Verical; ComponentLink4URL: https://datasheet.ciiva.com/724/exh-724390.pdf?src-supplier=Digikey; ComponentLink4Description: https://datasheet.ciiva.com/724/exh-724390.pdf?src-supplier=Digikey; ComponentLink5URL: https://datasheet.ciiva.com/8052/1684882-8052063.pdf?src-supplier=Element14; ComponentLink5Description: https://datasheet.ciiva.com/8052/1684882-8052063.pdf?src-supplier=Element14; Supplier Part Number 1: 5006945
Y100 = Crystal 10MHz: 10 MHz ±20ppm Crystal 18pF 50 Ohms HC-49/US; Supplier 1: Digikey; Supplier Part Number 1: XC3070CT-ND